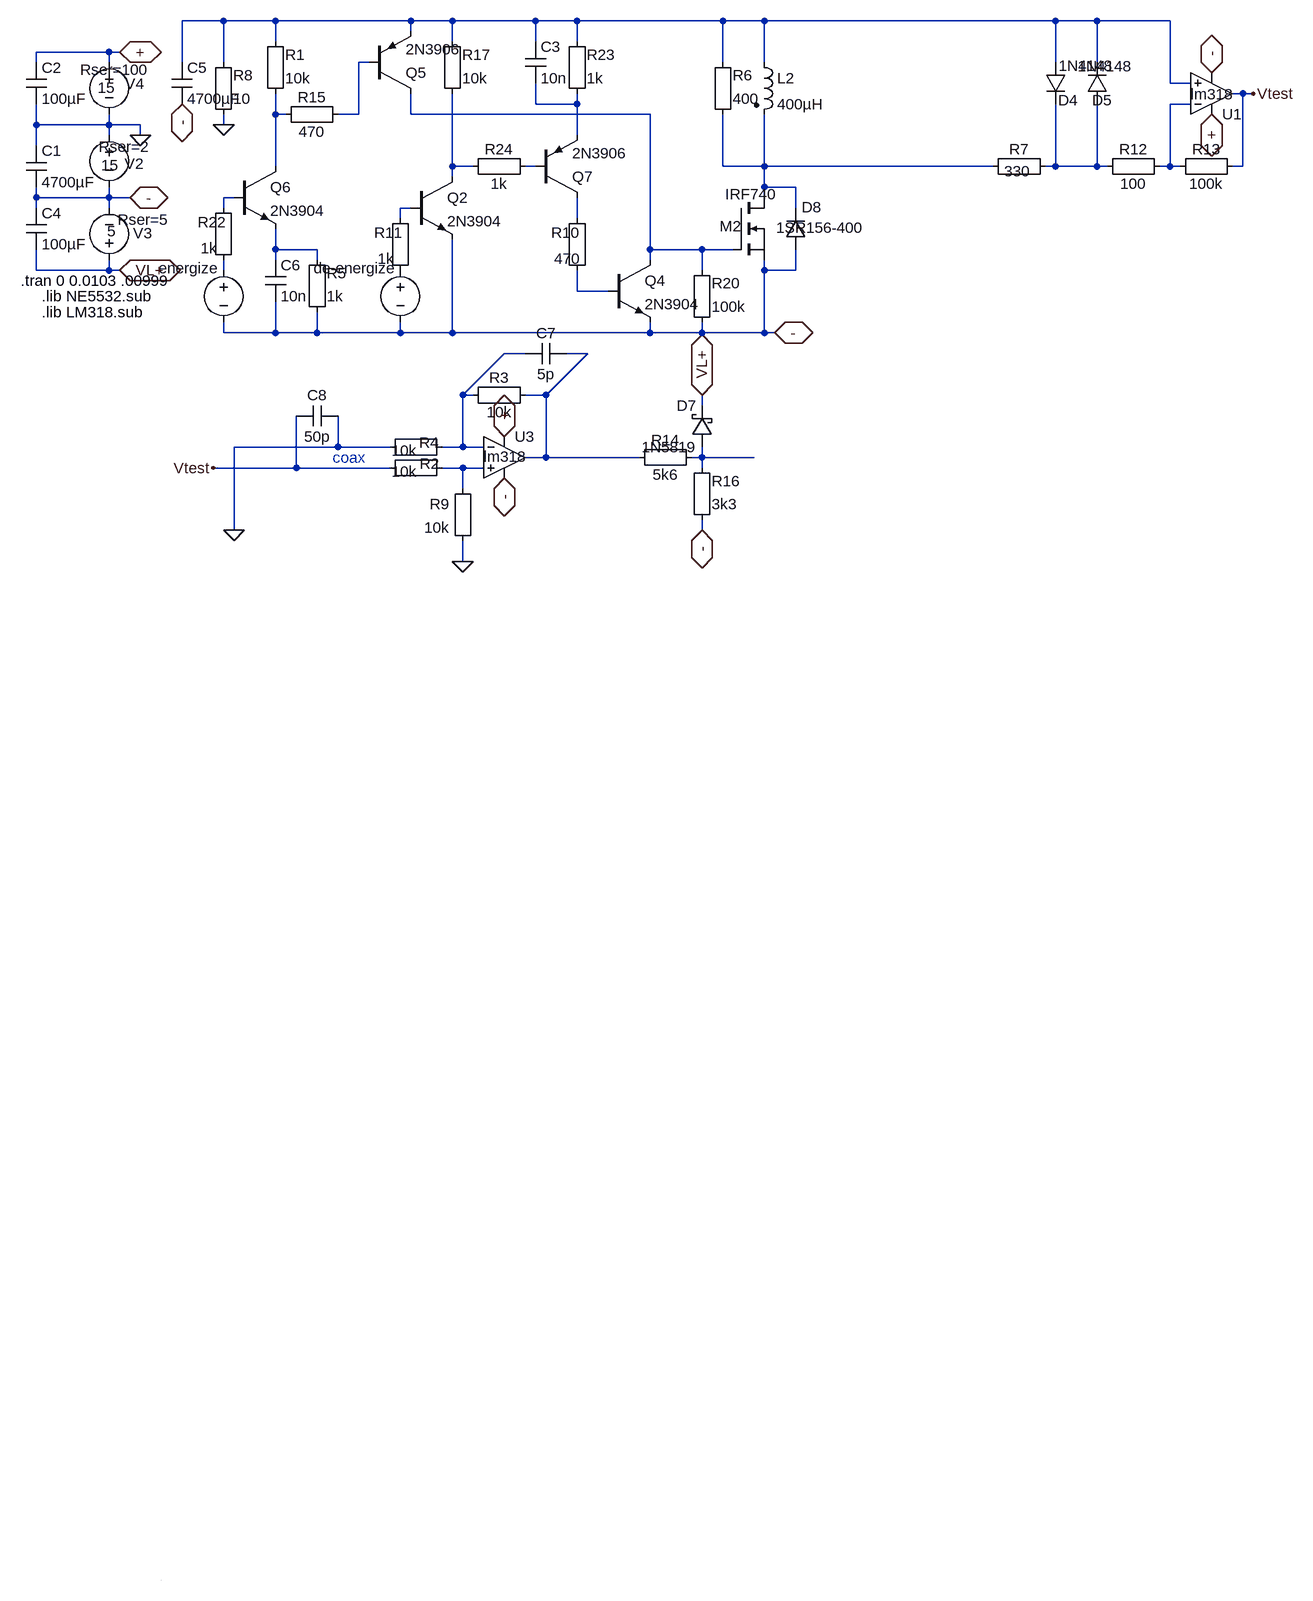
[diagram p0: schematic metal_low_power_fast_switch_4060.asc]
metal_low_power_fast_switch_4060.asc, the LTspice schematic file:
Version 4
SHEET 1 6068 1612
WIRE 96 -2400 32 -2400
WIRE 176 -2400 96 -2400
WIRE 384 -2400 176 -2400
WIRE 448 -2400 384 -2400
WIRE 576 -2400 448 -2400
WIRE 640 -2400 576 -2400
WIRE 864 -2400 640 -2400
WIRE 928 -2400 864 -2400
WIRE 1376 -2400 928 -2400
WIRE 1440 -2400 1376 -2400
WIRE 1552 -2400 1440 -2400
WIRE 384 -2384 384 -2400
WIRE 176 -2368 176 -2400
WIRE 448 -2368 448 -2400
WIRE 576 -2368 576 -2400
WIRE 640 -2368 640 -2400
WIRE -80 -2352 -192 -2352
WIRE -64 -2352 -80 -2352
WIRE -192 -2336 -192 -2352
WIRE -80 -2336 -80 -2352
WIRE 32 -2336 32 -2400
WIRE 96 -2336 96 -2400
WIRE 320 -2336 304 -2336
WIRE 864 -2336 864 -2400
WIRE 928 -2336 928 -2400
WIRE 1376 -2336 1376 -2400
WIRE 1440 -2336 1440 -2400
WIRE 1552 -2304 1552 -2400
WIRE 1584 -2304 1552 -2304
WIRE 1664 -2288 1648 -2288
WIRE 1680 -2288 1664 -2288
WIRE 576 -2272 576 -2304
WIRE 640 -2272 640 -2288
WIRE 640 -2272 576 -2272
WIRE 1584 -2272 1552 -2272
WIRE 176 -2256 176 -2288
WIRE 192 -2256 176 -2256
WIRE 304 -2256 304 -2336
WIRE 304 -2256 272 -2256
WIRE 384 -2256 384 -2288
WIRE 752 -2256 384 -2256
WIRE -192 -2240 -192 -2272
WIRE -80 -2240 -80 -2256
WIRE -80 -2240 -192 -2240
WIRE -32 -2240 -80 -2240
WIRE 96 -2240 96 -2256
WIRE -80 -2224 -80 -2240
WIRE -32 -2224 -32 -2240
WIRE 640 -2224 640 -2272
WIRE -192 -2208 -192 -2240
WIRE 176 -2176 176 -2256
WIRE 448 -2176 448 -2288
WIRE 480 -2176 448 -2176
WIRE 576 -2176 560 -2176
WIRE 864 -2176 864 -2256
WIRE 928 -2176 928 -2256
WIRE 928 -2176 864 -2176
WIRE 1280 -2176 928 -2176
WIRE 1376 -2176 1376 -2272
WIRE 1376 -2176 1360 -2176
WIRE 1440 -2176 1440 -2272
WIRE 1440 -2176 1376 -2176
WIRE 1456 -2176 1440 -2176
WIRE 1552 -2176 1552 -2272
WIRE 1552 -2176 1536 -2176
WIRE 1568 -2176 1552 -2176
WIRE 1664 -2176 1664 -2288
WIRE 1664 -2176 1648 -2176
WIRE 448 -2160 448 -2176
WIRE 928 -2144 928 -2176
WIRE 976 -2144 928 -2144
WIRE -192 -2128 -192 -2144
WIRE -80 -2128 -80 -2144
WIRE -80 -2128 -192 -2128
WIRE -48 -2128 -80 -2128
WIRE 112 -2128 96 -2128
WIRE 928 -2128 928 -2144
WIRE -192 -2112 -192 -2128
WIRE -80 -2112 -80 -2128
WIRE 96 -2112 96 -2128
WIRE 384 -2112 368 -2112
WIRE 976 -2112 976 -2144
WIRE 368 -2096 368 -2112
WIRE 640 -2096 640 -2128
WIRE 176 -2048 176 -2080
WIRE 240 -2048 176 -2048
WIRE 752 -2048 752 -2256
WIRE 832 -2048 752 -2048
WIRE 880 -2048 832 -2048
WIRE 176 -2032 176 -2048
WIRE 240 -2032 240 -2048
WIRE 752 -2032 752 -2048
WIRE -192 -2016 -192 -2048
WIRE -80 -2016 -80 -2032
WIRE -80 -2016 -192 -2016
WIRE -64 -2016 -80 -2016
WIRE 96 -2016 96 -2032
WIRE 832 -2016 832 -2048
WIRE 928 -2016 928 -2032
WIRE 976 -2016 976 -2048
WIRE 976 -2016 928 -2016
WIRE 640 -1984 640 -2016
WIRE 688 -1984 640 -1984
WIRE 96 -1920 96 -1936
WIRE 176 -1920 176 -1968
WIRE 176 -1920 96 -1920
WIRE 240 -1920 240 -1952
WIRE 240 -1920 176 -1920
WIRE 368 -1920 368 -1936
WIRE 368 -1920 240 -1920
WIRE 448 -1920 448 -2064
WIRE 448 -1920 368 -1920
WIRE 752 -1920 752 -1936
WIRE 752 -1920 448 -1920
WIRE 832 -1920 832 -1936
WIRE 832 -1920 752 -1920
WIRE 928 -1920 928 -2016
WIRE 928 -1920 832 -1920
WIRE 944 -1920 928 -1920
WIRE 560 -1888 528 -1888
WIRE 656 -1888 624 -1888
WIRE 464 -1824 528 -1888
WIRE 480 -1824 464 -1824
WIRE 592 -1824 656 -1888
WIRE 592 -1824 560 -1824
WIRE 832 -1808 832 -1824
WIRE 272 -1744 272 -1792
WIRE 272 -1744 112 -1744
WIRE 352 -1744 272 -1744
WIRE 464 -1744 464 -1824
WIRE 464 -1744 432 -1744
WIRE 496 -1744 464 -1744
WIRE 592 -1728 592 -1824
WIRE 592 -1728 560 -1728
WIRE 736 -1728 592 -1728
WIRE 832 -1728 832 -1744
WIRE 832 -1728 816 -1728
WIRE 912 -1728 832 -1728
WIRE 208 -1712 208 -1792
WIRE 208 -1712 80 -1712
WIRE 352 -1712 208 -1712
WIRE 464 -1712 432 -1712
WIRE 496 -1712 464 -1712
WIRE 832 -1712 832 -1728
WIRE 464 -1680 464 -1712
WIRE 112 -1616 112 -1744
WIRE 832 -1616 832 -1632
WIRE 464 -1568 464 -1600
WIRE 0 0 0 0
FLAG -48 -2128 -
IOPIN -48 -2128 BiDir
FLAG -64 -2352 +
IOPIN -64 -2352 BiDir
FLAG -32 -2224 0
FLAG -64 -2016 VL+
IOPIN -64 -2016 BiDir
FLAG 32 -2272 -
IOPIN 32 -2272 BiDir
FLAG 96 -2240 0
FLAG 1616 -2256 +
IOPIN 1616 -2256 BiDir
FLAG 1616 -2320 -
IOPIN 1616 -2320 BiDir
FLAG 832 -1616 -
IOPIN 832 -1616 BiDir
FLAG 832 -1824 VL+
IOPIN 832 -1824 BiDir
FLAG 944 -1920 -
IOPIN 944 -1920 BiDir
FLAG 528 -1760 +
IOPIN 528 -1760 BiDir
FLAG 528 -1696 -
IOPIN 528 -1696 BiDir
FLAG 1680 -2288 Vtest
FLAG 80 -1712 Vtest
FLAG 464 -1568 0
FLAG 112 -1616 0
SYMBOL voltage -80 -2240 M0
WINDOW 123 0 0 Left 2
WINDOW 39 -63 34 Left 2
WINDOW 0 -53 60 Left 2
WINDOW 3 -15 62 Left 2
SYMATTR SpiceLine Rser=2
SYMATTR InstName V2
SYMATTR Value 15
SYMBOL voltage -80 -2352 M0
WINDOW 123 0 0 Left 2
WINDOW 39 -61 27 Left 2
WINDOW 0 -54 49 Left 2
WINDOW 3 -9 55 Left 2
SYMATTR SpiceLine Rser=100
SYMATTR InstName V4
SYMATTR Value 15
SYMBOL voltage -80 -2016 M180
WINDOW 123 0 0 Left 2
WINDOW 39 13 78 Left 2
WINDOW 0 37 57 Left 2
WINDOW 3 -3 60 Left 2
SYMATTR SpiceLine Rser=5
SYMATTR InstName V3
SYMATTR Value 5
SYMBOL Misc\\EuropeanCap -208 -2208 R0
SYMATTR InstName C1
SYMATTR Value 4700µF
SYMATTR SpiceLine V=400 Irms=1 Rser=.32 Lser=0
SYMBOL Misc\\EuropeanCap -208 -2336 R0
SYMATTR InstName C2
SYMATTR Value 100µF
SYMATTR SpiceLine V=400 Irms=1 Rser=.32 Lser=0
SYMBOL Misc\\EuropeanCap -208 -2112 R0
SYMATTR InstName C4
SYMATTR Value 100µF
SYMATTR SpiceLine V=400 Irms=1 Rser=.32 Lser=0
SYMBOL Misc\\EuropeanCap 16 -2336 R0
SYMATTR InstName C5
SYMATTR Value 4700µF
SYMATTR SpiceLine V=400 Irms=1 Rser=.32 Lser=0
SYMBOL ind2 912 -2352 R0
SYMATTR InstName L2
SYMATTR Value 400µH
SYMATTR SpiceLine Rser=.5 Cpar=400p
SYMATTR Type ind
SYMBOL Misc\\EuropeanResistor 848 -2240 M180
WINDOW 0 31 76 Left 2
WINDOW 3 31 40 Left 2
SYMATTR InstName R6
SYMATTR Value 400
SYMBOL Misc\\EuropeanResistor 1264 -2192 M90
WINDOW 0 5 56 VBottom 2
WINDOW 3 8 53 VTop 2
SYMATTR InstName R7
SYMATTR Value 330
SYMBOL diode 1360 -2336 R0
WINDOW 3 21 5 Left 2
WINDOW 0 20 58 Left 2
SYMATTR Value 1N4148
SYMATTR InstName D4
SYMBOL diode 1456 -2272 R180
WINDOW 0 -7 6 Left 2
WINDOW 3 -39 58 Left 2
SYMATTR InstName D5
SYMATTR Value 1N4148
SYMBOL Misc\\EuropeanResistor 80 -2240 M180
WINDOW 0 31 76 Left 2
WINDOW 3 31 40 Left 2
SYMATTR InstName R8
SYMATTR Value 10
SYMBOL nmos 880 -2128 R0
WINDOW 0 -21 44 Left 2
WINDOW 3 -12 -5 Left 2
SYMATTR InstName M2
SYMATTR Value IRF740
SYMBOL voltage 368 -2032 M0
WINDOW 0 5 13 Left 2
WINDOW 3 -134 119 Invisible 2
WINDOW 123 0 0 Left 2
SYMATTR InstName de-energize
SYMATTR Value PULSE(0 4.8 .01015 0 0 .000002 .01 1000)
SYMATTR SpiceLine Rser=0
SYMBOL npn3 384 -2160 R0
SYMATTR InstName Q2
SYMATTR Value 2N3904
SYMBOL Misc\\EuropeanResistor 352 -2000 M180
WINDOW 0 -24 74 Left 2
WINDOW 3 -19 34 Left 2
SYMATTR InstName R11
SYMATTR Value 1k
SYMBOL Opamps\\opamp2 1616 -2224 M180
WINDOW 3 -32 63 Left 2
SYMATTR Value lm318
SYMATTR InstName U1
SYMBOL Misc\\EuropeanResistor 1440 -2160 R270
WINDOW 0 27 56 VTop 2
WINDOW 3 5 56 VBottom 2
SYMATTR InstName R12
SYMATTR Value 100
SYMBOL Misc\\EuropeanResistor 1552 -2160 R270
WINDOW 0 27 56 VTop 2
WINDOW 3 5 56 VBottom 2
SYMATTR InstName R13
SYMATTR Value 100k
SYMBOL Misc\\EuropeanResistor 720 -1712 R270
WINDOW 0 27 56 VTop 2
WINDOW 3 5 56 VBottom 2
SYMATTR InstName R14
SYMATTR Value 5k6
SYMBOL Misc\\EuropeanResistor 816 -1616 M180
WINDOW 0 31 76 Left 2
WINDOW 3 31 40 Left 2
SYMATTR InstName R16
SYMATTR Value 3k3
SYMBOL schottky 848 -1744 R180
WINDOW 0 24 64 Left 2
WINDOW 3 24 0 Left 2
SYMATTR InstName D7
SYMATTR Value 1N5819
SYMATTR Description Diode
SYMATTR Type diode
SYMBOL npn3 688 -2032 R0
SYMATTR InstName Q4
SYMATTR Value 2N3904
SYMBOL diode 992 -2048 R180
WINDOW 0 -24 65 Left 2
WINDOW 3 -90 34 Left 2
SYMATTR InstName D8
SYMATTR Value 1SR156-400
SYMATTR Description Zener Diode
SYMATTR Type zener
SYMBOL pnp2 320 -2288 M180
SYMATTR InstName Q5
SYMATTR Value 2N3906
SYMBOL Misc\\EuropeanResistor 816 -1920 M180
WINDOW 0 31 76 Left 2
WINDOW 3 31 40 Left 2
SYMATTR InstName R20
SYMATTR Value 100k
SYMBOL voltage 96 -2032 M0
WINDOW 0 7 13 Left 2
WINDOW 3 -134 119 Invisible 2
WINDOW 123 0 0 Left 2
SYMATTR InstName energize
SYMATTR Value PULSE(0 4.8 .01 0 0 .0000021 .01 1000)
SYMATTR SpiceLine Rser=0
SYMBOL npn3 112 -2176 R0
SYMATTR InstName Q6
SYMATTR Value 2N3904
SYMBOL Misc\\EuropeanResistor 80 -2016 M180
WINDOW 0 -24 74 Left 2
WINDOW 3 -19 34 Left 2
SYMATTR InstName R22
SYMATTR Value 1k
SYMBOL pnp2 576 -2128 M180
SYMATTR InstName Q7
SYMATTR Value 2N3906
SYMBOL Misc\\EuropeanResistor 624 -2272 M180
WINDOW 0 31 76 Left 2
WINDOW 3 31 40 Left 2
SYMATTR InstName R23
SYMATTR Value 1k
SYMBOL Misc\\EuropeanResistor 464 -2192 M90
WINDOW 0 5 56 VBottom 2
WINDOW 3 27 56 VTop 2
SYMATTR InstName R24
SYMATTR Value 1k
SYMBOL Opamps\\opamp2 528 -1792 R0
WINDOW 3 -32 63 Left 2
SYMATTR Value lm318
SYMATTR InstName U3
SYMBOL Misc\\EuropeanResistor 464 -1840 M90
WINDOW 0 5 56 VBottom 2
WINDOW 3 27 56 VTop 2
SYMATTR InstName R3
SYMATTR Value 10k
SYMBOL Misc\\EuropeanCap 624 -1872 M270
WINDOW 0 32 32 VTop 2
WINDOW 3 0 32 VBottom 2
SYMATTR InstName C7
SYMATTR Value 5p
SYMATTR SpiceLine V=400 Irms=1 Rser=.32 Lser=0
SYMBOL Misc\\EuropeanCap 272 -1776 M270
WINDOW 0 32 32 VTop 2
WINDOW 3 0 32 VBottom 2
SYMATTR InstName C8
SYMATTR Value 50p
SYMATTR SpiceLine V=400 Irms=1 Rser=.32 Lser=0
SYMBOL Misc\\EuropeanResistor 336 -1728 M90
WINDOW 0 25 77 VBottom 2
WINDOW 3 6 38 VTop 2
SYMATTR InstName R2
SYMATTR Value 10k
SYMBOL Misc\\EuropeanResistor 480 -1696 M0
SYMATTR InstName R9
SYMATTR Value 10k
SYMBOL Misc\\EuropeanResistor 336 -1760 M90
WINDOW 0 25 76 VBottom 2
WINDOW 3 6 38 VTop 2
SYMATTR InstName R4
SYMATTR Value 10k
SYMBOL Misc\\EuropeanCap 560 -2368 R0
SYMATTR InstName C3
SYMATTR Value 10n
SYMATTR SpiceLine V=400 Irms=1 Rser=.32 Lser=0
SYMBOL Misc\\EuropeanResistor 224 -1936 M180
WINDOW 0 31 76 Left 2
WINDOW 3 31 40 Left 2
SYMATTR InstName R5
SYMATTR Value 1k
SYMBOL Misc\\EuropeanCap 160 -2032 R0
SYMATTR InstName C6
SYMATTR Value 10n
SYMATTR SpiceLine V=400 Irms=1 Rser=.32 Lser=0
SYMBOL Misc\\EuropeanResistor 624 -2000 M180
WINDOW 0 -24 74 Left 2
WINDOW 3 -19 34 Left 2
SYMATTR InstName R10
SYMATTR Value 470
SYMBOL Misc\\EuropeanResistor 176 -2272 M90
WINDOW 0 5 56 VBottom 2
WINDOW 3 27 56 VTop 2
SYMATTR InstName R15
SYMATTR Value 470
SYMBOL Misc\\EuropeanResistor 160 -2272 M180
WINDOW 0 31 76 Left 2
WINDOW 3 31 40 Left 2
SYMATTR InstName R1
SYMATTR Value 10k
SYMBOL Misc\\EuropeanResistor 432 -2272 M180
WINDOW 0 31 76 Left 2
WINDOW 3 31 40 Left 2
SYMATTR InstName R17
SYMATTR Value 10k
TEXT -216 -2000 Left 2 !.tran 0 0.0103 .00999
TEXT -184 -1976 Left 2 !.lib NE5532.sub
TEXT -184 -1952 Left 2 !.lib LM318.sub
TEXT 264 -1728 Left 2 ;coax

The netlist it stands for:
* metal_low_power_fast_switch_4060.asc
V2 0 - 15 Rser=2
V4 + 0 15 Rser=100
V3 VL+ - 5 Rser=5
C1 0 - 4700µF V=400 Irms=1 Rser=.32 Lser=0
C2 + 0 100µF V=400 Irms=1 Rser=.32 Lser=0
C4 - VL+ 100µF V=400 Irms=1 Rser=.32 Lser=0
C5 N001 - 4700µF V=400 Irms=1 Rser=.32 Lser=0
L2 N001 N009 400µH Rser=.5 Cpar=400p
R6 N009 N001 400
R7 N009 N010 330
D4 N001 N010 1N4148
D5 N010 N001 1N4148
R8 0 N001 10
M2 N009 N006 - - IRF740
V§de-energize P001 - PULSE(0 4.8 .01015 0 0 .000002 .01 1000) Rser=0
Q2 N007 N012 - 0 2N3904
R11 P001 N012 1k
XU1 N001 N004 + - Vtest lm318  ; pins In+ In- V+ V- OUT
R12 N010 N004 100
R13 N004 Vtest 100k
R14 N018 N019 5k6
R16 - N019 3k3
D7 N019 VL+ 1N5819
Q4 N006 N016 - 0 2N3904
D8 - N009 1SR156-400
Q5 N006 N002 N001 0 2N3906
R20 - N006 100k
V§energize N015 - PULSE(0 4.8 .01 0 0 .0000021 .01 1000) Rser=0
Q6 N005 N011 N014 0 2N3904
R22 N015 N011 1k
Q7 N013 N008 N003 0 2N3906
R23 N003 N001 1k
R24 N007 N008 1k
XU3 N020 N017 + - N018 lm318  ; pins In+ In- V+ V- OUT
R3 N017 N018 10k
C7 N018 N017 5p V=400 Irms=1 Rser=.32 Lser=0
C8 0 Vtest 50p V=400 Irms=1 Rser=.32 Lser=0
R2 Vtest N020 10k
R9 N020 0 10k
R4 0 N017 10k
C3 N001 N003 10n V=400 Irms=1 Rser=.32 Lser=0
R5 - N014 1k
C6 N014 - 10n V=400 Irms=1 Rser=.32 Lser=0
R10 N016 N013 470
R15 N005 N002 470
R1 N005 N001 10k
R17 N007 N001 10k
.model D D
.lib standard.dio
.model NPN NPN
.model PNP PNP
.lib standard.bjt
.model NMOS NMOS
.model PMOS PMOS
.lib standard.mos
.tran 0 0.0103 .00999
.lib NE5532.sub
.lib LM318.sub
* coax
.backanno
.end